# Altium schematic sheet Multiplexer Bank.SchDoc
size A4
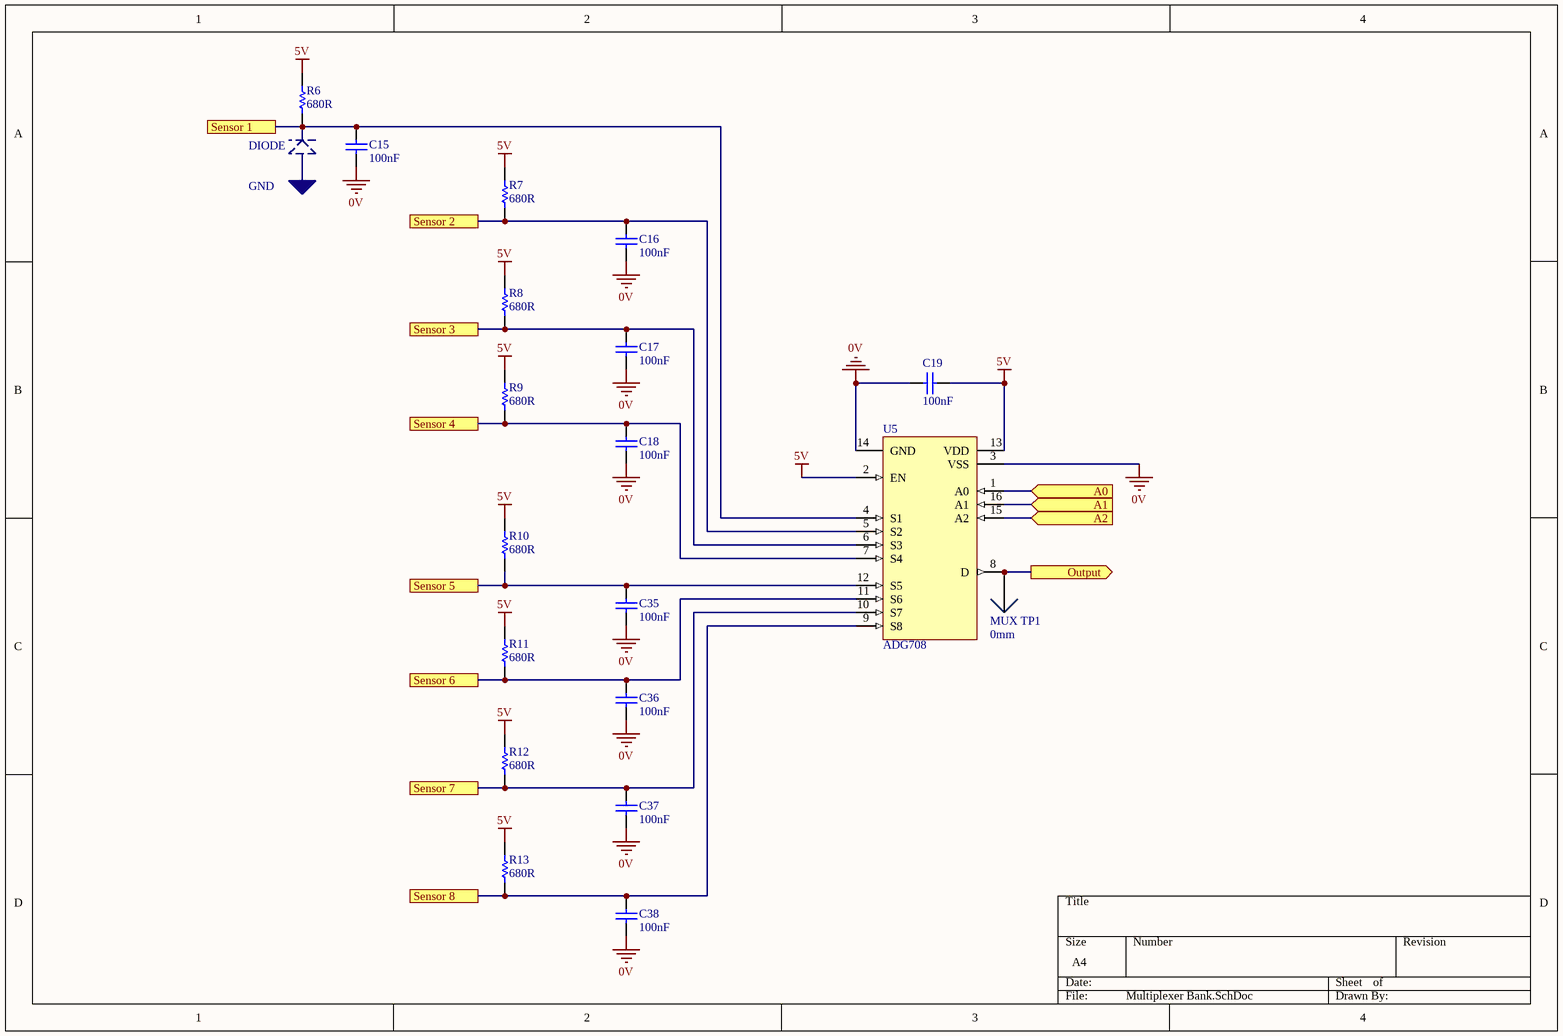
[diagram p0: Multiplexer Bank.SchDoc]

## Parts
C15  100nF  [0805]
C16  100nF  [0805]
C17  100nF  [0805]
C18  100nF  [0805]
C19  100nF  [0805]
C35  100nF  [0805]
C36  100nF  [0805]
C37  100nF  [0805]
C38  100nF  [0805]
MUX_TP1  0mm  [SMD Test Point]
R6  680R  [0805]
R7  680R  [0805]
R8  680R  [0805]
R9  680R  [0805]
R10  680R  [0805]
R11  680R  [0805]
R12  680R  [0805]
R13  680R  [0805]
U5  ADG708  [AD 16-TSSOP]

## Ports
A0 (in), A1 (in), A2 (in), Output (out), Sensor 1, Sensor 2, Sensor 3, Sensor 4, Sensor 5, Sensor 6, Sensor 7, Sensor 8

## Nets
0V: C15.1 C16.1 C17.1 C18.1 C19.1 C35.1 C36.1 C37.1 C38.1 U5.3(VSS) U5.14(GND)
5V: C19.2 R6.2 R7.2 R8.2 R9.2 R10.2 R11.2 R12.2 R13.2 U5.2(EN) U5.13(VDD)
A0: U5.1(A0) ; port A0
A1: U5.16(A1) ; port A1
A2: U5.15(A2) ; port A2
Output: MUX_TP1.1 U5.8(D) ; port Output
Sensor 1: C15.2 R6.1 U5.4(S1) ; port Sensor 1
Sensor 2: C16.2 R7.1 U5.5(S2) ; port Sensor 2
Sensor 3: C17.2 R8.1 U5.6(S3) ; port Sensor 3
Sensor 4: C18.2 R9.1 U5.7(S4) ; port Sensor 4
Sensor 5: C35.2 R10.1 U5.12(S5) ; port Sensor 5
Sensor 6: C36.2 R11.1 U5.11(S6) ; port Sensor 6
Sensor 7: C37.2 R12.1 U5.10(S7) ; port Sensor 7
Sensor 8: C38.2 R13.1 U5.9(S8) ; port Sensor 8

## Notes on the sheet
- (near R6) DIODE
- GND

## Library data of the parts
C15-C19 C35-C38 = GCM21BR71E104KA37L: Manufacturer: muRata; Tolerance: 10%; Material: X7R; Rated Voltage: 25V; Part Number: GCM21BR71E104KA37L; Value: 100nF
MUX_TP1 = SMD Test Point: Positions: 1; Row Spacing: 0; Flange: No; Contact: NA; Part Number: SMD Test Point; Pitch: 0mm; Angle: 0
R6-R13 = RC0805FR07680RL: Manufacturer: YAGEO; Tolerance: 0.01; Rated Voltage: 0.125W; Part Number: RC0805FR07680RL; Value: 680R; Material: FR-07
U5 = ADG708: 1 Circuit IC Switch 8:1 4.5Ohm 16-TSSOP; Manufacturer: Analog Devices; Part Number: ADG708; Digikey Part Number: ADG708BRUZ-ND; Digikey Link: https://www.digikey.com/product-detail/en/analog-devices-inc/ADG708BRUZ/ADG708BRUZ-ND/820104